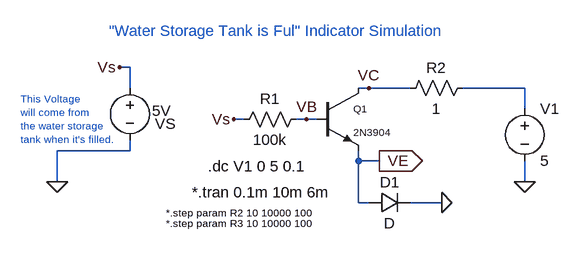
[diagram p0: schematic LTSpice_StorageTank.asc]
LTSpice_StorageTank.asc, the LTspice schematic file:
Version 4
SHEET 1 880 680
WIRE -304 -336 -320 -336
WIRE -304 -304 -304 -336
WIRE 64 -304 48 -304
WIRE 128 -304 64 -304
WIRE 304 -304 208 -304
WIRE 304 -272 304 -304
WIRE -128 -256 -144 -256
WIRE -32 -256 -48 -256
WIRE -16 -256 -32 -256
WIRE -304 -208 -304 -224
WIRE -304 -208 -416 -208
WIRE 48 -192 48 -208
WIRE 80 -192 48 -192
WIRE -416 -160 -416 -208
WIRE 304 -160 304 -192
WIRE 48 -128 48 -192
WIRE 64 -128 48 -128
WIRE 176 -128 128 -128
FLAG -416 -160 0
FLAG -320 -336 Vs
FLAG -144 -256 Vs
FLAG -32 -256 VB
FLAG 64 -304 VC
FLAG 304 -160 0
FLAG 176 -128 0
FLAG 80 -192 VE
IOPIN 80 -192 Out
SYMBOL voltage -304 -320 R0
WINDOW 0 39 71 Left 2
WINDOW 3 34 51 Left 2
SYMATTR InstName VS
SYMATTR Value 5V
SYMBOL res -32 -272 R90
WINDOW 0 0 56 VBottom 2
WINDOW 3 32 56 VTop 2
SYMATTR InstName R1
SYMATTR Value 100k
SYMBOL npn -16 -304 R0
WINDOW 0 56 32 Left 1
WINDOW 3 56 68 Left 1
SYMATTR InstName Q1
SYMATTR Value 2N3904
SYMBOL voltage 304 -288 R0
SYMATTR InstName V1
SYMATTR Value 5
SYMBOL res 224 -320 R90
WINDOW 0 0 56 VBottom 2
WINDOW 3 32 56 VTop 2
SYMATTR InstName R2
SYMATTR Value 1
SYMBOL diode 64 -144 M90
WINDOW 0 0 32 VBottom 2
WINDOW 3 32 32 VTop 2
SYMATTR InstName D1
TEXT -336 -392 Left 2 ;"Water Storage Tank is Ful" Indicator Simulation
TEXT -472 -288 Left 1 ;This Voltage \nwill come from\nthe water storage\ntank when it's filled.
TEXT -184 -184 Left 2 !.dc V1 0 5 0.1
TEXT -208 -144 Left 2 !*.tran 0.1m 10m 6m
TEXT -248 -112 Left 1 !*.step param R2 10 10000 100
TEXT -248 -96 Left 1 !*.step param R3 10 10000 100

The netlist it stands for:
* LTSpice_StorageTank.asc
VS Vs 0 5V
R1 VB Vs 100k
Q1 VC VB VE 0 2N3904
V1 N001 0 5
R2 N001 VC 1
D1 VE 0 D
.model D D
.lib standard.dio
.model NPN NPN
.model PNP PNP
.lib standard.bjt
* "Water Storage Tank is Ful" Indicator Simulation
* This Voltage
* will come from
* the water storage
* tank when it's filled.
.dc V1 0 5 0.1
*.tran 0.1m 10m 6m
*.step param R2 10 10000 100
*.step param R3 10 10000 100
.backanno
.end